# Altium schematic sheet Power.SchDoc
size A4
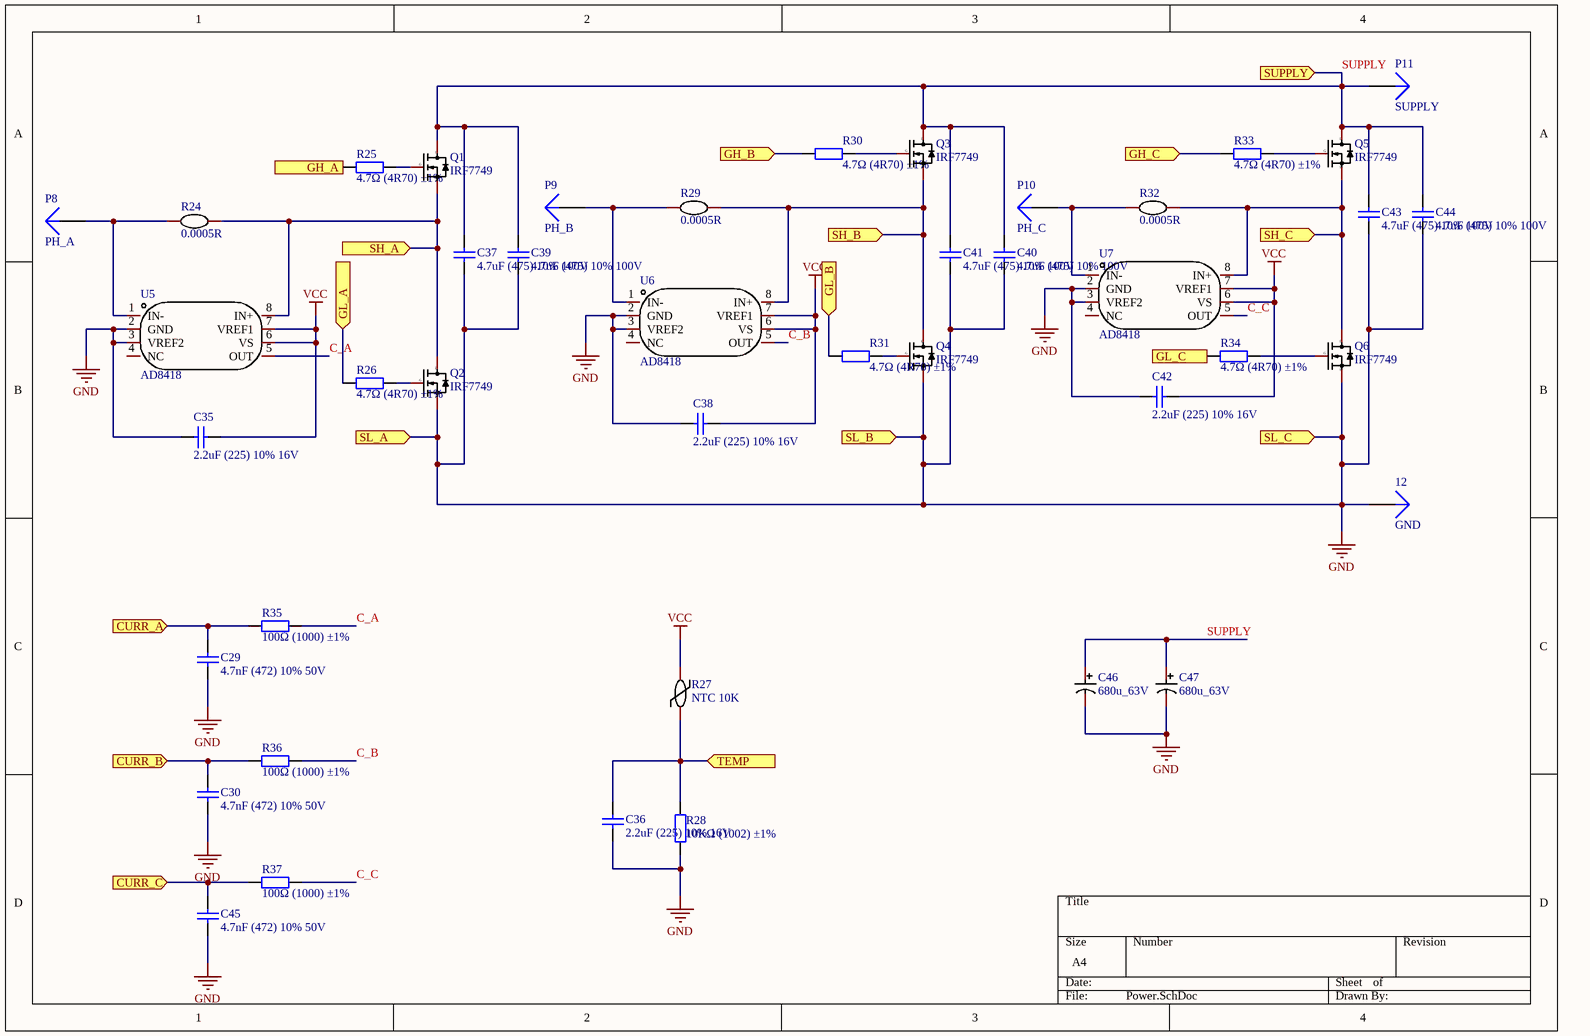
[diagram p0: Power.SchDoc]

## Parts
12  GND  [Power PAD6x6]
C29  4.7nF (472) 10% 50V  [0603_C]
C30  4.7nF (472) 10% 50V  [0603_C]
C35  2.2uF (225) 10% 16V  [0603_C]
C36  2.2uF (225) 10% 16V  [0603_C]
C37  4.7uF (475) 10% 100V  [1210_C]
C38  2.2uF (225) 10% 16V  [0603_C]
C39  4.7uF (475) 10% 100V  [1210_C]
C40  4.7uF (475) 10% 100V  [1210_C]
C41  4.7uF (475) 10% 100V  [1210_C]
C42  2.2uF (225) 10% 16V  [0603_C]
C43  4.7uF (475) 10% 100V  [1210_C]
C44  4.7uF (475) 10% 100V  [1210_C]
C45  4.7nF (472) 10% 50V  [0603_C]
C46  680u_63V  [680u_63V]
C47  680u_63V  [680u_63V]
P8  PH_A  [POWER PAD]
P9  PH_B  [POWER PAD]
P10  PH_C  [POWER PAD]
P11  SUPPLY  [Power PAD6x6]
Q1  IRF7749  [IRF7749]
Q2  IRF7749  [IRF7749]
Q3  IRF7749  [IRF7749]
Q4  IRF7749  [IRF7749]
Q5  IRF7749  [IRF7749]
Q6  IRF7749  [IRF7749]
R24  0.0005R  [0.0005R]
R25  4.7Ω (4R70) ±1%  [0603_R]
R26  4.7Ω (4R70) ±1%  [0603_R]
R27  NTC 10K  [NTC 10K]
R28  10KΩ (1002) ±1%  [0603_R]
R29  0.0005R  [0.0005R]
R30  4.7Ω (4R70) ±1%  [0603_R]
R31  4.7Ω (4R70) ±1%  [0603_R]
R32  0.0005R  [0.0005R]
R33  4.7Ω (4R70) ±1%  [0603_R]
R34  4.7Ω (4R70) ±1%  [0603_R]
R35  100Ω (1000) ±1%  [0603_R]
R36  100Ω (1000) ±1%  [0603_R]
R37  100Ω (1000) ±1%  [0603_R]
U5  AD8418  [AD8418]
U6  AD8418  [AD8418]
U7  AD8418  [AD8418]

## Ports
CURR_A (in), CURR_B (in), CURR_C (in), GH_A (in), GH_B (in), GH_C (in), GL_A (in), GL_B (in), GL_C (in), SH_A (in), SH_B (in), SH_C (in), SL_A (in), SL_B (in), SL_C (in), SUPPLY (in), TEMP (in)

## Nets
GND: 12.1 C29.1 C30.1 C35.1 C36.1 C37.1 C38.1 C39.1 C40.1 C41.1 C42.1 C43.1 C44.1 C45.1 C46.2 C47.2 Q2.3(S) Q4.3(S) Q6.3(S) R28.1 U5.2(GND) U5.3(VREF2) U6.2(GND) U6.3(VREF2) U7.2(GND) U7.3(VREF2) ; port SL_A, port SL_B, port SL_C
VCC: C35.2 C38.2 C42.2 R27.2 U5.6(VS) U5.7(VREF1) U6.6(VS) U6.7(VREF1) U7.6(VS) U7.7(VREF1)
C_A: R35.2 U5.5(OUT)
C_B: R36.2 U6.5(OUT)
C_C: R37.2 U7.5(OUT)
CURR_A: C29.2 R35.1 ; port CURR_A
CURR_B: C30.2 R36.1 ; port CURR_B
CURR_C: C45.2 R37.1 ; port CURR_C
GH_A: R25.1 ; port GH_A
GH_B: R30.1 ; port GH_B
GH_C: R33.1 ; port GH_C
GL_A: R26.1 ; port GL_A
GL_B: R31.1 ; port GL_B
GL_C: R34.1 ; port GL_C
SH_A: Q1.3(S) Q2.4(D) R24.2 U5.8(IN+) ; port SH_A
SH_B: Q3.3(S) Q4.4(D) R29.2 U6.8(IN+) ; port SH_B
SH_C: Q5.3(S) Q6.4(D) R32.2 U7.8(IN+) ; port SH_C
SUPPLY: C37.2 C39.2 C40.2 C41.2 C43.2 C44.2 C46.1 C47.1 P11.1 Q1.4(D) Q3.4(D) Q5.4(D) ; port SUPPLY
TEMP: C36.2 R27.1 R28.2 ; port TEMP
NetP8_1: P8.1 R24.1 U5.1(IN-)
NetP9_1: P9.1 R29.1 U6.1(IN-)
NetP10_1: P10.1 R32.1 U7.1(IN-)
NetQ1_1: Q1.1(G) R25.2
NetQ2_1: Q2.1(G) R26.2
NetQ3_1: Q3.1(G) R30.2
NetQ4_1: Q4.1(G) R31.2
NetQ5_1: Q5.1(G) R33.2
NetQ6_1: Q6.1(G) R34.2

Not connected (* = marked no-connect by the designer): U5 4(NC); U6 4(NC); U7 4(NC)

## Library data of the parts
12 P8-P11 = Plug: LatestRevisionDate: 17-Jul-2002; LatestRevisionNote: Re-released for DXP Platform.; Publisher: Altium Limited
C29 C30 C45 = 0603 4.7nF (472) 10% 50V: 贴片电容; ComponentLink1Description: 供应商链接; ComponentLink1URL: http://www.szlcsc.com/product/details_55004.html; Package: 0603; Supplier: LC; SuppliersPartNumber: C53987
C35 C36 C38 C42 = 0603 2.2uF (225) 10% 16V: 贴片电容; ComponentLink1Description: 供应商链接; ComponentLink1URL: http://www.szlcsc.com/product/details_24366.html; Package: 0603; Supplier: LC; SuppliersPartNumber: C23630
C37 C39-C41 C43 C44 = 0603 4.7uF (475) 10% 16V: 贴片电容; ComponentLink1Description: 供应商链接; ComponentLink1URL: http://www.szlcsc.com/product/details_20375.html; Package: 0603; Supplier: LC; SuppliersPartNumber: C19666
R25 R26 R30 R31 R33 R34 = 0603 4.7Ω (4R70) 1%: 贴片电阻; ComponentLink1Description: 供应商链接; ComponentLink1URL: http://www.szlcsc.com/product/details_23891.html; Package: 0603; Supplier: LC; SuppliersPartNumber: C23164
R28 = 0603 10KΩ (1002) 1%: 贴片电阻; ComponentLink1Description: 供应商链接; ComponentLink1URL: http://www.szlcsc.com/product/details_26547.html; Package: 0603; Supplier: LC; SuppliersPartNumber: C25804
R35-R37 = 0603 100Ω (1000) 1%: 贴片电阻; ComponentLink1Description: 供应商链接; ComponentLink1URL: http://www.szlcsc.com/product/details_23502.html; Package: 0603; Supplier: LC; SuppliersPartNumber: C22775